# Altium schematic sheet Rough-Design.SchDoc
size B
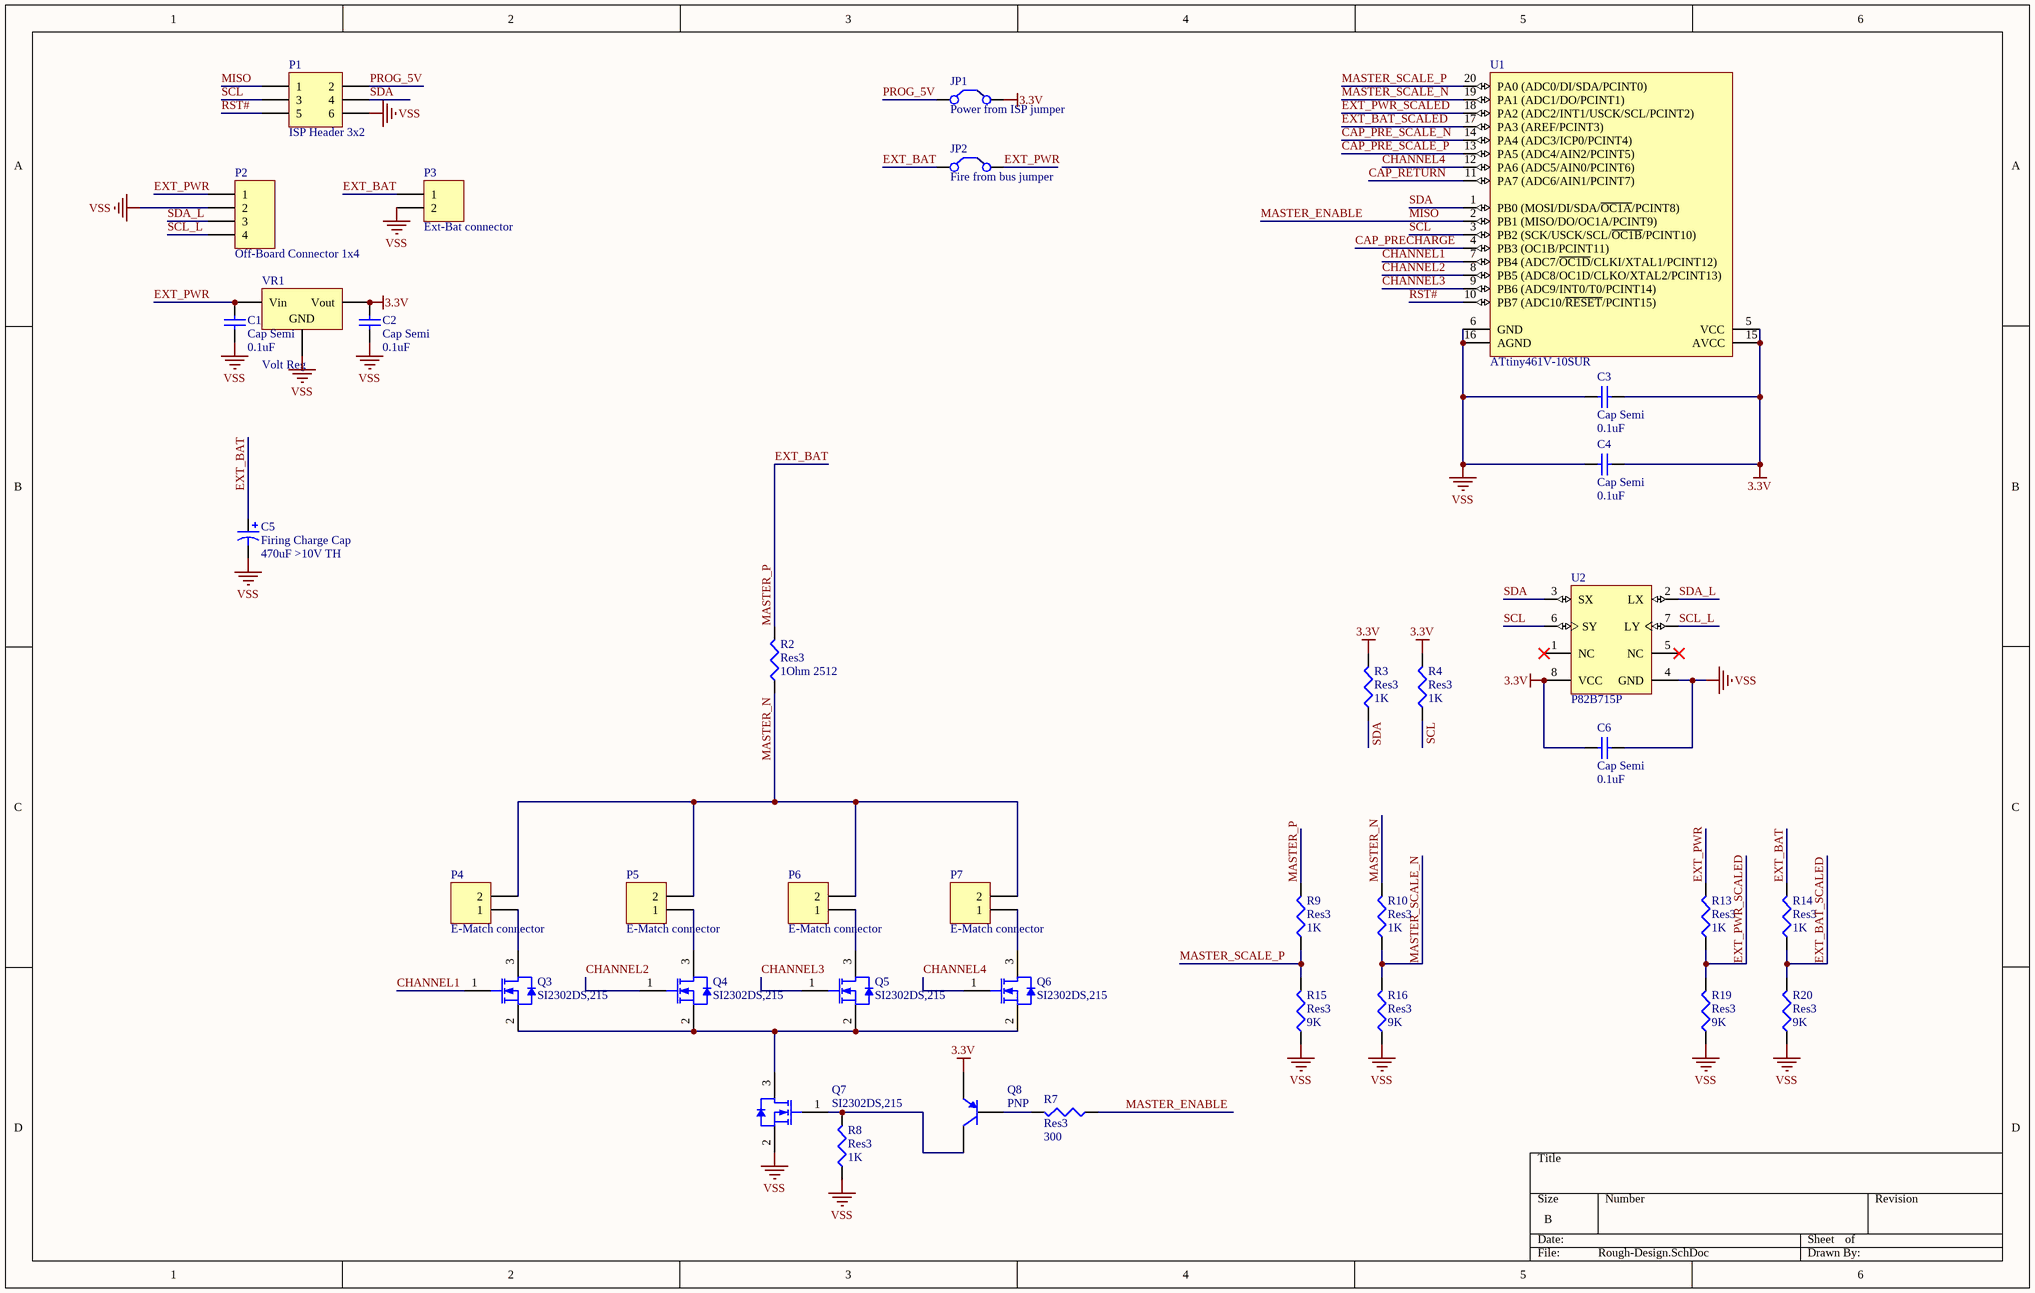
[diagram p0: Rough-Design.SchDoc]

## Parts
C1  Cap Semi  value 0.1uF  [1608[0603]]
C2  Cap Semi  value 0.1uF  [1608[0603]]
C3  Cap Semi  value 0.1uF  [C1206]
C4  Cap Semi  value 0.1uF  [C1206]
C5  Firing Charge Cap  value 470uF >10V TH  [RB7.6-15]
C6  Cap Semi  value 0.1uF  [C1206]
JP1  Power from ISP jumper  [SOLDER-JUMPER]
JP2  Fire from bus jumper  [SOLDER-JUMPER]
P1  ISP Header 3x2  [HDR2X3]
P2  Off-Board Connector 1x4  [HDR1X4]
P3  Ext-Bat connector  [HDR1X2]
P4  E-Match connector  [HDR1X2]
P5  E-Match connector  [HDR1X2]
P6  E-Match connector  [HDR1X2]
P7  E-Match connector  [HDR1X2]
Q3  SI2302DS,215  [NXP-SOT23_N]
Q4  SI2302DS,215  [NXP-SOT23_N]
Q5  SI2302DS,215  [NXP-SOT23_N]
Q6  SI2302DS,215  [NXP-SOT23_N]
Q7  SI2302DS,215  [NXP-SOT23_N]
Q8  PNP  [SOT-23B_N]
R2  Res3  value 1Ohm 2512  [14-1210]
R3  Res3  value 1K  [J1-0603]
R4  Res3  value 1K  [J1-0603]
R7  Res3  value 300  [J1-0603]
R8  Res3  value 1K  [J1-0603]
R9  Res3  value 1K  [J1-0603]
R10  Res3  value 1K  [J1-0603]
R13  Res3  value 1K  [J1-0603]
R14  Res3  value 1K  [J1-0603]
R15  Res3  value 9K  [J1-0603]
R16  Res3  value 9K  [J1-0603]
R19  Res3  value 9K  [J1-0603]
R20  Res3  value 9K  [J1-0603]
U1  ATtiny461V-10SUR  [20S2_M]
U2  P82B715P  [P8]
VR1  Volt Reg  [D2PAK_N]

## Nets
3.3V: C2.2 C3.2 C4.2 C6.1 JP1.2(C2) Q8.3(E) R3.2 R4.2 U1.5(VCC) U1.15(AVCC) U2.8(VCC) VR1.3(Vout)
VSS: C1.1 C2.1 C3.1 C4.1 C5.2 C6.2 P1.6 P2.2 P3.2 Q7.2(S) R8.1 R15.1 R16.1 R19.1 R20.1 U1.6(GND) U1.16(AGND) U2.4(GND) VR1.2(GND)
CAP_PRE_SCALE_N: U1.14(PA4_(ADC3/ICP0/PCINT4))
CAP_PRE_SCALE_P: U1.13(PA5_(ADC4/AIN2/PCINT5))
CAP_PRECHARGE: U1.4(PB3_(OC1B/PCINT11))
CAP_RETURN: U1.11(PA7_(ADC6/AIN1/PCINT7))
CHANNEL1: Q3.1(G) U1.7(PB4_(ADC7/~{OC1D}/CLKI/XTAL1/PCINT12))
CHANNEL2: Q4.1(G) U1.8(PB5_(ADC8/OC1D/CLKO/XTAL2/PCINT13))
CHANNEL3: Q5.1(G) U1.9(PB6_(ADC9/INT0/T0/PCINT14))
CHANNEL4: Q6.1(G) U1.12(PA6_(ADC5/AIN0/PCINT6))
EXT_BAT: C5.1 JP2.1(C1) P3.1 R2.2 R9.2 R14.2  [also labelled MASTER_P]
EXT_BAT_SCALED: R14.1 R20.2 U1.17(PA3_(AREF/PCINT3))
EXT_PWR: C1.2 JP2.2(C2) P2.1 R13.2 VR1.1(Vin)
EXT_PWR_SCALED: R13.1 R19.2 U1.18(PA2_(ADC2/INT1/USCK/SCL/PCINT2))
MASTER_ENABLE: P1.1 R7.1 U1.2(PB1_(MISO/DO/OC1A/PCINT9))  [also labelled MISO]
MASTER_N: P4.2 P5.2 P6.2 P7.2 R2.1 R10.2
MASTER_SCALE_N: R10.1 R16.2 U1.19(PA1_(ADC1/DO/PCINT1))
MASTER_SCALE_P: R9.1 R15.2 U1.20(PA0_(ADC0/DI/SDA/PCINT0))
PROG_5V: JP1.1(C1) P1.2
RST#: P1.5 U1.10(PB7_(ADC10/~{RESET}/PCINT15))
SCL: P1.3 R4.1 U1.3(PB2_(SCK/USCK/SCL/~{OC1B}/PCINT10)) U2.6(SY)
SCL_L: P2.4 U2.7(LY)
SDA: P1.4 R3.1 U1.1(PB0_(MOSI/DI/SDA/~{OC1A}/PCINT8)) U2.3(SX)
SDA_L: P2.3 U2.2(LX)
NetP4_1: P4.1 Q3.3(D)
NetP5_1: P5.1 Q4.3(D)
NetP6_1: P6.1 Q5.3(D)
NetP7_1: P7.1 Q6.3(D)
NetQ3_2: Q3.2(S) Q4.2(S) Q5.2(S) Q6.2(S) Q7.3(D)
NetQ7_1: Q7.1(G) Q8.1(C) R8.2
NetQ8_2: Q8.2(B) R7.2

Not connected (* = marked no-connect by the designer): U2 1(NC)* 5(NC)*

## Library data of the parts
C1-C4 C6 = Cap Semi: Capacitor (Semiconductor SIM Model); Published: 8-Jun-2000; LatestRevisionDate: 29-May-2009; LatestRevisionNote: IPC-7351 Footprint Added.; PackageReference: C1206; Publisher: Altium Limited; PackageDescription: Chip Capacitor
C5 = Cap Pol1: Polarized Capacitor (Radial); Published: 8-Jun-2000; LatestRevisionDate: 17-Jul-2002; LatestRevisionNote: Re-released for DXP Platform.; PackageReference: RB7.6-15; Publisher: Altium Limited; PackageDescription: Polarized Capacitor (Radial); 2 Leads
JP1 JP2 = SolderJumper: Solder Configuration Jumper; Published: 24-Mar-1999; LatestRevisionDate: 17-Jul-2002; LatestRevisionNote: Re-released for DXP Platform.; PackageReference: RAD-0.2; Publisher: Altium Limited; PackageDescription: Radial Cap, Thru-Hole; 2 Leads; 0.2 in Pin Spacing
P1 = Header 3X2: Header, 3-Pin, Dual row; LatestRevisionDate: 17-Jul-2002; LatestRevisionNote: Re-released for DXP Platform.; Publisher: Altium Limited
P2 = Header 4: Header, 4-Pin; LatestRevisionDate: 17-Jul-2002; LatestRevisionNote: Re-released for DXP Platform.; Publisher: Altium Limited
P3-P7 = Header 2: Header, 2-Pin; LatestRevisionDate: 17-Jul-2002; LatestRevisionNote: Re-released for DXP Platform.; Publisher: Altium Limited
Q3-Q7 = CMP-1258-00133-1: N-Channel Enhancement Mode Field-Effect Transistor, 20 V, 2.5 A, 3-Pin SOT23, Tape and Reel; Manufacturer: NXP Semiconductors; Ciss [typ] (pF): 230; VDS [max] (V): 20; Channel Type: N; Coss [typ] (pF): 125; ID [max] (A): 2.5; Packing: Tape & Reel; DatasheetVersion: Rev. 02; PackageVersion: 06-03-16, 03/2006; Code_JEDEC: TO-236AB; ComponentLink3Description: Package Specification; PartNumber: SI2302DS,215; ComponentLink2URL: http://www.nxp.com/documents/data_sheet/SI2302DS.pdf; PackageDescription: 3-Pin Small Outline Transistor Package, Body 2.9 x 1.3 mm, Pitch 0.95 mm; ComponentLink2Description: Datasheet; ComponentLink1Description: Manufacturer URL; Mounting Technology: Surface Mount; ComponentLink1URL: http://www.nxp.com/; ComponentLink3URL: http://www.nxp.com/documents/outline_drawing/sot023_po.pdf; PackageReference: SOT23
Q8 = PNP: PNP Bipolar Transistor; Published: 8-Jun-2000; LatestRevisionDate: 29-May-2009; LatestRevisionNote: IPC-7351 Footprint Added.; PackageVersion: Aug-1999; PackageReference: SOT-23B; Publisher: Altium Limited; PackageDescription: 3-Pin SOT-23 Package 0.95 mm Pitch, 2.4 mm Lead Span
R2-R4 R7-R10 R13-R16 R19 R20 = Res3: Resistor; Published: 8-Jun-2000; LatestRevisionDate: 29-May-2009; LatestRevisionNote: IPC-7351 Footprint Added.; PackageReference: J1-0603; Publisher: Altium Limited; PackageDescription: Chip Resistor
U1 = CMP-0093-00289-1: 8-bit AVR Microcontroller, 1.8-5.5V, 10MHz, 4KB Flash, 256 Bytes EEPROM, 256 Bytes SRAM, 20-pin SOIC, Industrial Grade (-40°C to 85°C), Reel; ComponentLink1URL: http://www.atmel.com/; ComponentLink1Description: Manufacturer URL; PackageDescription: 20-lead, 0.300" Wide Body, Plastic Gull Wing Small Outline Package (SOIC); DatasheetVersion: revE, Aug-2010; ComponentLink2Description: ATtiny261/461/861 Datasheet; Code_IPC: SOIC127P1030-20; ComponentLink3URL: http://www.atmel.com/dyn/resources/prod_documents/2588S.pdf; PackageReference: 20S2; PackageVersion: revB, Nov-2006; ComponentLink3Description: ATtiny261/461/861 Summary; ComponentLink2URL: http://www.atmel.com/dyn/resources/prod_documents/doc2588.pdf; Code_JEDEC: MS-013-AC
U2 = CMP-0314-00015-1: I2C Bus Extender, 2 Channel Width, 3.0 to 12.0 V, -40 to 85 degC, 8-pin PDIP (P), Pb-Free (RoHS); Manufacturer: Texas Instruments; Channel Width: 2; Open Drain I/O Type: Yes; VCC(Min)(V): 3; VCC(Max)(V): 12; Eco-Plan: Green (RoHS & no Sb/Br); SubFamily: I2C Hub, Buffer, Repeater; Master Side I2C Bus Capacitance Supported(pF): 400; ComponentLink1Description: Datasheet; PackageDescription: 8-Pin Plastic Dual-In-Line Package, Row Spacing 7.62 mm, Pitch 2.54 mm; Mounting Technology: Through-hole; PartNumber: P82B715P; DatasheetVersion: SCPS145A; Vcc range(V): 3.0 to 12.0; ComponentLink2URL: http://www.ti.com/litv/pdf/mpdi001b; PackageVersion: revE, Apr-2010; PackageReference: P8; ComponentLink2Description: Package Specification; 5V Tolerant I/O: Yes; ComponentLink1URL: http://www.ti.com/general/docs/lit/getliterature.tsp?genericPartNumber=P82B715&fileType=pdf; Max Frequency(kHz): 400; Code_JEDEC: MS-001-BA; Slave Side I2C Bus Capacitance Supported(pF): 400
VR1 = Volt Reg: Voltage Regulator; Published: 24-Mar-1999; LatestRevisionDate: 29-May-2009; LatestRevisionNote: IPC-7351 Footprint Added.; PackageReference: D2PAK; Publisher: Altium Limited; PackageDescription: 3-Pin Transistor Outline Package 2.54 mm Pitch, 15.1 mm Lead Span